# Altium schematic sheet Sheet1.SchDoc
size A4; SheetNumber: 1; SheetTotal: 1
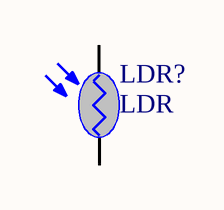
[diagram p0: Sheet1.SchDoc]

## Parts
LDR?  LDR  [CDS]

## Nets

Not connected (* = marked no-connect by the designer): LDR? 1(A) 2(K)

## Library data of the parts
LDR? = LDR: Quang Tro